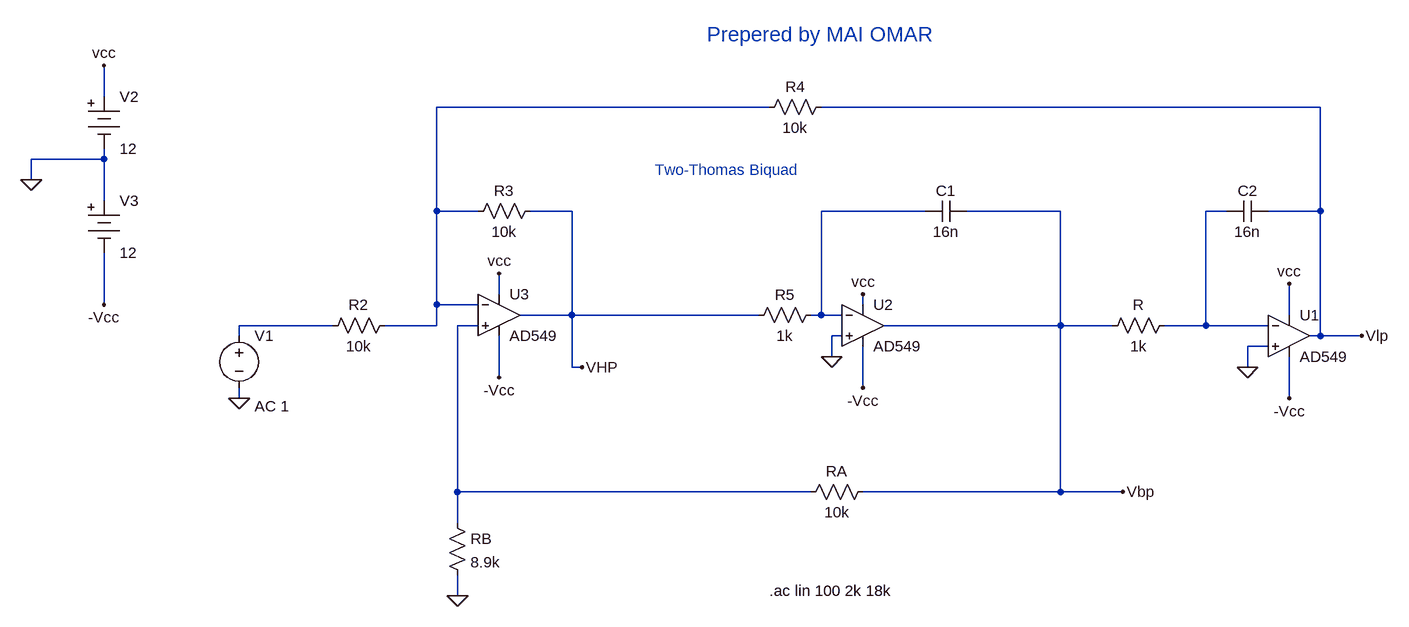
[diagram p0: schematic ass2_TTF_Mai Omar.asc]
ass2_TTF_Mai Omar.asc, the LTspice schematic file:
Version 4
SHEET 1 1176 680
WIRE -816 -288 -816 -336
WIRE 208 -272 -304 -272
WIRE 1056 -272 288 -272
WIRE -816 -192 -816 -208
WIRE -816 -192 -928 -192
WIRE -928 -160 -928 -192
WIRE -816 -128 -816 -192
WIRE -304 -112 -304 -272
WIRE -240 -112 -304 -112
WIRE -96 -112 -160 -112
WIRE 448 -112 288 -112
WIRE 656 -112 512 -112
WIRE 912 -112 880 -112
WIRE 1056 -112 1056 -272
WIRE 1056 -112 976 -112
WIRE -208 16 -208 -16
WIRE -816 32 -816 -48
WIRE -304 32 -304 -112
WIRE -240 32 -304 32
WIRE 352 32 352 16
WIRE -96 48 -96 -112
WIRE -96 48 -176 48
WIRE 192 48 -96 48
WIRE 288 48 288 -112
WIRE 288 48 272 48
WIRE 320 48 288 48
WIRE 1008 48 1008 0
WIRE -464 64 -608 64
WIRE -304 64 -304 32
WIRE -304 64 -384 64
WIRE -240 64 -272 64
WIRE 656 64 656 -112
WIRE 656 64 384 64
WIRE 736 64 656 64
WIRE 880 64 880 -112
WIRE 880 64 816 64
WIRE 976 64 880 64
WIRE -608 80 -608 64
WIRE 320 80 304 80
WIRE 1056 80 1056 -112
WIRE 1056 80 1040 80
WIRE 1120 80 1056 80
WIRE 976 96 944 96
WIRE 304 112 304 80
WIRE -96 128 -96 48
WIRE -80 128 -96 128
WIRE 944 128 944 96
WIRE -208 144 -208 80
WIRE 352 160 352 96
WIRE -608 176 -608 160
WIRE 1008 176 1008 112
WIRE -272 320 -272 64
WIRE 272 320 -272 320
WIRE 656 320 656 64
WIRE 656 320 352 320
WIRE 752 320 656 320
WIRE -272 368 -272 320
WIRE -272 480 -272 448
FLAG 1120 80 Vlp
FLAG 752 320 Vbp
FLAG 304 112 0
FLAG 944 128 0
FLAG -272 480 0
FLAG -608 176 0
FLAG -928 -160 0
FLAG -816 -336 vcc
FLAG -816 32 -Vcc
FLAG -208 -16 vcc
FLAG 352 16 vcc
FLAG 1008 0 vcc
FLAG -208 144 -Vcc
FLAG 352 160 -Vcc
FLAG 1008 176 -Vcc
FLAG -80 128 VHP
SYMBOL res -288 352 R0
SYMATTR InstName RB
SYMATTR Value 8.9k
SYMBOL res -480 80 R270
WINDOW 0 32 56 VTop 2
WINDOW 3 0 56 VBottom 2
SYMATTR InstName R2
SYMATTR Value 10k
SYMBOL res -256 -96 R270
WINDOW 0 32 56 VTop 2
WINDOW 3 0 56 VBottom 2
SYMATTR InstName R3
SYMATTR Value 10k
SYMBOL res 192 -256 R270
WINDOW 0 32 56 VTop 2
WINDOW 3 0 56 VBottom 2
SYMATTR InstName R4
SYMATTR Value 10k
SYMBOL res 176 64 R270
WINDOW 0 32 56 VTop 2
WINDOW 3 0 56 VBottom 2
SYMATTR InstName R5
SYMATTR Value 1k
SYMBOL res 720 80 R270
WINDOW 0 32 56 VTop 2
WINDOW 3 0 56 VBottom 2
SYMATTR InstName R
SYMATTR Value 1k
SYMBOL cap 512 -128 R90
WINDOW 0 0 32 VBottom 2
WINDOW 3 32 32 VTop 2
SYMATTR InstName C1
SYMATTR Value 16n
SYMBOL cap 976 -128 R90
WINDOW 0 0 32 VBottom 2
WINDOW 3 32 32 VTop 2
SYMATTR InstName C2
SYMATTR Value 16n
SYMBOL res 368 304 R90
WINDOW 0 0 56 VBottom 2
WINDOW 3 32 56 VTop 2
SYMATTR InstName RA
SYMATTR Value 10k
SYMBOL voltage -608 64 R0
WINDOW 123 24 124 Left 2
WINDOW 39 0 0 Left 0
SYMATTR Value2 AC 1
SYMATTR InstName V1
SYMATTR Value ""
SYMBOL Misc\\battery -816 -304 R0
WINDOW 123 0 0 Left 0
WINDOW 39 0 0 Left 0
SYMATTR InstName V2
SYMATTR Value 12
SYMBOL Misc\\battery -816 -144 R0
WINDOW 123 0 0 Left 0
WINDOW 39 0 0 Left 0
SYMATTR InstName V3
SYMATTR Value 12
SYMBOL OpAmps\\AD549 1008 16 R0
SYMATTR InstName U1
SYMBOL OpAmps\\AD549 352 0 R0
SYMATTR InstName U2
SYMBOL OpAmps\\AD549 -208 -16 R0
SYMATTR InstName U3
TEXT 208 472 Left 2 !.ac lin 100 2k 18k
TEXT 112 -384 Left 3 ;Prepered by MAI OMAR
TEXT 32 -176 Left 2 ;Two-Thomas Biquad

The netlist it stands for:
* ass2_TTF_Mai Omar.asc
RB N005 0 8.9k
R2 N004 N001 10k
R3 N001 VHP 10k
R4 N001 Vlp 10k
R5 VHP N002 1k
R Vbp N003 1k
C1 Vbp N002 16n
C2 Vlp N003 16n
RA Vbp N005 10k
V1 N004 0 AC 1
V2 vcc 0 12
V3 0 -Vcc 12
XU1 0 N003 vcc -Vcc Vlp AD549  ; pins In+ In- V+ V- OUT
XU2 0 N002 vcc -Vcc Vbp AD549  ; pins In+ In- V+ V- OUT
XU3 N005 N001 vcc -Vcc VHP AD549  ; pins In+ In- V+ V- OUT
.ac lin 100 2k 18k
* Prepered by MAI OMAR
* Two-Thomas Biquad
.backanno
.end